# EAGLE design untitled (EAGLE 9.6.2)
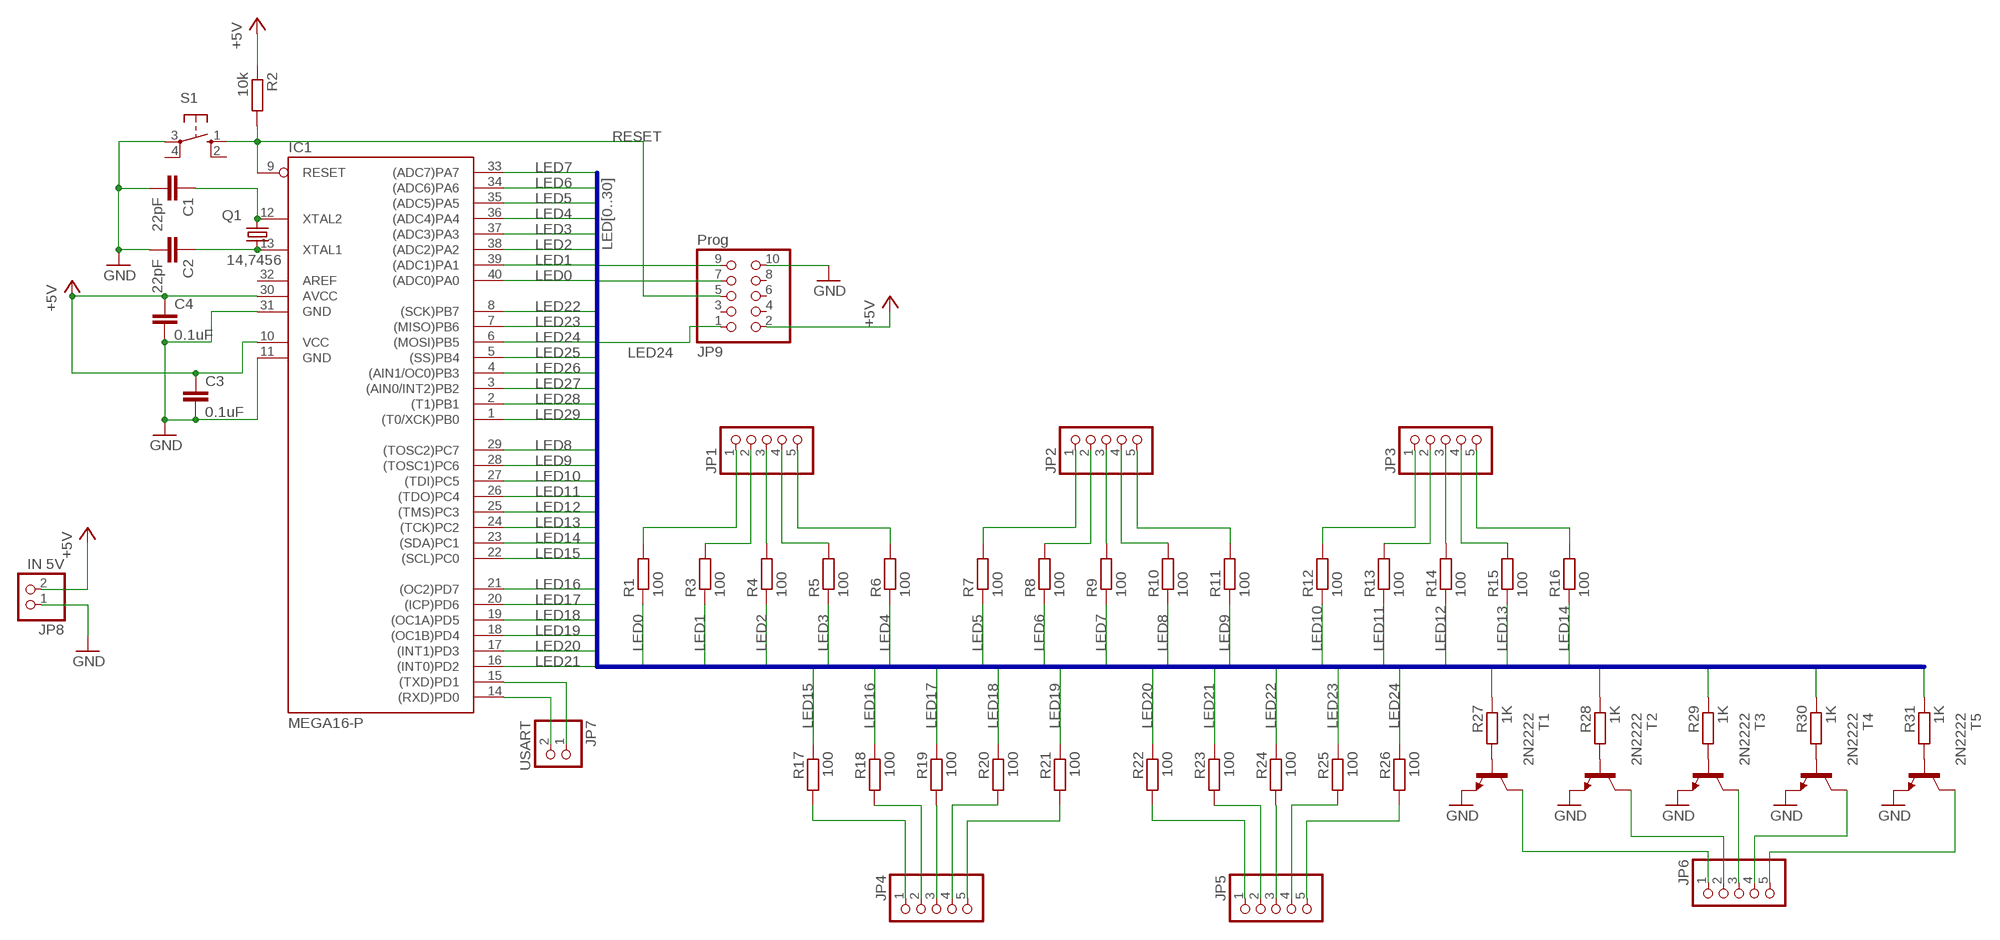
[diagram p0: schematic, sheet 1]

## Parts
C1  22pF  C-EU025-025X050  [C025-025X050]
C2  22pF  C-EU025-025X050  [C025-025X050]
C3  0.1uF  C-EU025-025X050  [C025-025X050]
C4  0.1uF  C-EU025-025X050  [C025-025X050]
IC1  MEGA16-P  [DIL40]
JP1  PINHD-1X5  [1X05]
JP2  PINHD-1X5  [1X05]
JP3  PINHD-1X5  [1X05]
JP4  PINHD-1X5  [1X05]
JP5  PINHD-1X5  [1X05]
JP6  PINHD-1X5  [1X05]
JP7  USART  PINHD-1X2/90  [1X02/90]
JP8  IN 5V  PINHD-1X2/90  [1X02/90]
JP9  Prog  PINHD-2X5  [2X05]
Q1  14,7456  CRYSTALHC49S  [HC49/S]
R1  100  R-EU_0207/7  [0207/7]
R2  10k  R-EU_0207/7  [0207/7]
R3  100  R-EU_0207/7  [0207/7]
R4  100  R-EU_0207/7  [0207/7]
R5  100  R-EU_0207/7  [0207/7]
R6  100  R-EU_0207/7  [0207/7]
R7  100  R-EU_0207/7  [0207/7]
R8  100  R-EU_0207/7  [0207/7]
R9  100  R-EU_0207/7  [0207/7]
R10  100  R-EU_0207/7  [0207/7]
R11  100  R-EU_0207/7  [0207/7]
R12  100  R-EU_0207/7  [0207/7]
R13  100  R-EU_0207/7  [0207/7]
R14  100  R-EU_0207/7  [0207/7]
R15  100  R-EU_0207/7  [0207/7]
R16  100  R-EU_0207/7  [0207/7]
R17  100  R-EU_0207/7  [0207/7]
R18  100  R-EU_0207/7  [0207/7]
R19  100  R-EU_0207/7  [0207/7]
R20  100  R-EU_0207/7  [0207/7]
R21  100  R-EU_0207/7  [0207/7]
R22  100  R-EU_0207/7  [0207/7]
R23  100  R-EU_0207/7  [0207/7]
R24  100  R-EU_0207/7  [0207/7]
R25  100  R-EU_0207/7  [0207/7]
R26  100  R-EU_0207/7  [0207/7]
R27  1K  R-EU_0207/7  [0207/7]
R28  1K  R-EU_0207/7  [0207/7]
R29  1K  R-EU_0207/7  [0207/7]
R30  1K  R-EU_0207/7  [0207/7]
R31  1K  R-EU_0207/7  [0207/7]
S1  10-XX  [B3F-10XX]
T1  2N2222  [TO18]
T2  2N2222  [TO18]
T3  2N2222  [TO18]
T4  2N2222  [TO18]
T5  2N2222  [TO18]

## Nets
+5V: C3.1 C4.1 IC1.10(VCC) IC1.30(AVCC) JP8.2 JP9.2 R2.1
GND: C1.2 C2.2 C3.2 C4.2 IC1.11(GND) IC1.31(GND) JP8.1 JP9.10 S1.3(P) T1.1(E) T2.1(E) T3.1(E) T4.1(E) T5.1(E)
LED0: IC1.40((ADC0)PA0) R1.1
LED1: IC1.39((ADC1)PA1) R3.1
LED2: IC1.38((ADC2)PA2) R4.1
LED3: IC1.37((ADC3)PA3) R5.1
LED4: IC1.36((ADC4)PA4) R6.1
LED5: IC1.35((ADC5)PA5) R7.1
LED6: IC1.34((ADC6)PA6) R8.1
LED7: IC1.33((ADC7)PA7) R9.1
LED8: IC1.29((TOSC2)PC7) R10.1
LED9: IC1.28((TOSC1)PC6) R11.1
LED10: IC1.27((TDI)PC5) R12.1
LED11: IC1.26((TDO)PC4) R13.1
LED12: IC1.25((TMS)PC3) R14.1
LED13: IC1.24((TCK)PC2) R15.1
LED14: IC1.23((SDA)PC1) R16.1
LED15: IC1.22((SCL)PC0) R17.1
LED16: IC1.21((OC2)PD7) R18.1
LED17: IC1.20((ICP)PD6) R19.1
LED18: IC1.19((OC1A)PD5) R20.1
LED19: IC1.18((OC1B)PD4) R21.1
LED20: IC1.17((INT1)PD3) R22.1
LED21: IC1.16((INT0)PD2) R23.1
LED22: IC1.8((SCK)PB7) JP9.7 R24.1
LED23: IC1.7((MISO)PB6) JP9.9 R25.1
LED24: IC1.6((MOSI)PB5) JP9.1 R26.1
LED25: IC1.5((SS)PB4) R27.1
LED26: IC1.4((AIN1/OC0)PB3) R28.1
LED27: IC1.3((AIN0/INT2)PB2) R29.1
LED28: IC1.2((T1)PB1) R30.1
LED29: IC1.1((T0/XCK)PB0) R31.1
N$2: JP1.3 R4.2
N$3: JP1.4 R5.2
N$4: JP1.5 R6.2
N$5: JP1.2 R3.2
N$6: JP1.1 R1.2
N$7: JP2.3 R9.2
N$8: JP2.4 R10.2
N$9: JP2.2 R8.2
N$10: JP2.5 R11.2
N$11: JP2.1 R7.2
N$12: JP3.3 R14.2
N$13: JP3.4 R15.2
N$14: JP3.2 R13.2
N$15: JP3.5 R16.2
N$16: JP3.1 R12.2
N$17: JP4.3 R19.2
N$18: JP4.4 R20.2
N$19: JP4.2 R18.2
N$20: JP4.5 R21.2
N$21: JP4.1 R17.2
N$22: JP5.3 R24.2
N$23: JP5.4 R25.2
N$24: JP5.2 R23.2
N$25: JP5.5 R26.2
N$26: JP5.1 R22.2
N$27: JP6.4 T4.3(C)
N$28: JP6.5 T5.3(C)
N$29: JP6.3 T3.3(C)
N$30: JP6.2 T2.3(C)
N$31: JP6.1 T1.3(C)
N$32: IC1.14((RXD)PD0) JP7.2
N$33: IC1.15((TXD)PD1) JP7.1
N$34: C1.1 IC1.12(XTAL2) Q1.2
N$35: C2.1 IC1.13(XTAL1) Q1.1
N$36: R27.2 T1.2(B)
N$37: R28.2 T2.2(B)
N$38: R29.2 T3.2(B)
N$39: R30.2 T4.2(B)
N$40: R31.2 T5.2(B)
RESET: IC1.9(RESET) JP9.5 R2.2 S1.1(S)
Unconnected: IC1.32(AREF) JP9.3 JP9.4 JP9.6 JP9.8 S1.2(S1) S1.4(P1)

## Buses
LED[0..30]

## Library data of the parts
C1-C4 = resistor:C-EU: CAPACITOR, European symbol
IC1 = atmel:MEGA16-P: MICROCONTROLLER 16 Kbytes FLASH 1 kbytes SRAM 512 bytes EEPROM USART 8-channel 10 bit ADC Source: avr.lbr; MPN: ATMEGA16-16PU; OC_FARNELL: 9171142; OC_NEWARK: 01M6885
JP1-JP6 = pinhead:PINHD-1X5: PIN HEADER
JP7 JP8 = pinhead:PINHD-1X2: PIN HEADER
JP9 = pinhead:PINHD-2X5: PIN HEADER
Q1 = crystal:CRYSTAL: CRYSTAL; OC_FARNELL: 1667008; OC_NEWARK: unknown
R1-R31 = resistor:R-EU_: RESISTOR, European symbol
S1 = switch-omron:10-XX: OMRON SWITCH; MPN: B3F-1000; OC_FARNELL: 176432; OC_NEWARK: 36M3542
T1-T5 = transistor:2N2222: NPN TRANSISTOR

## Board
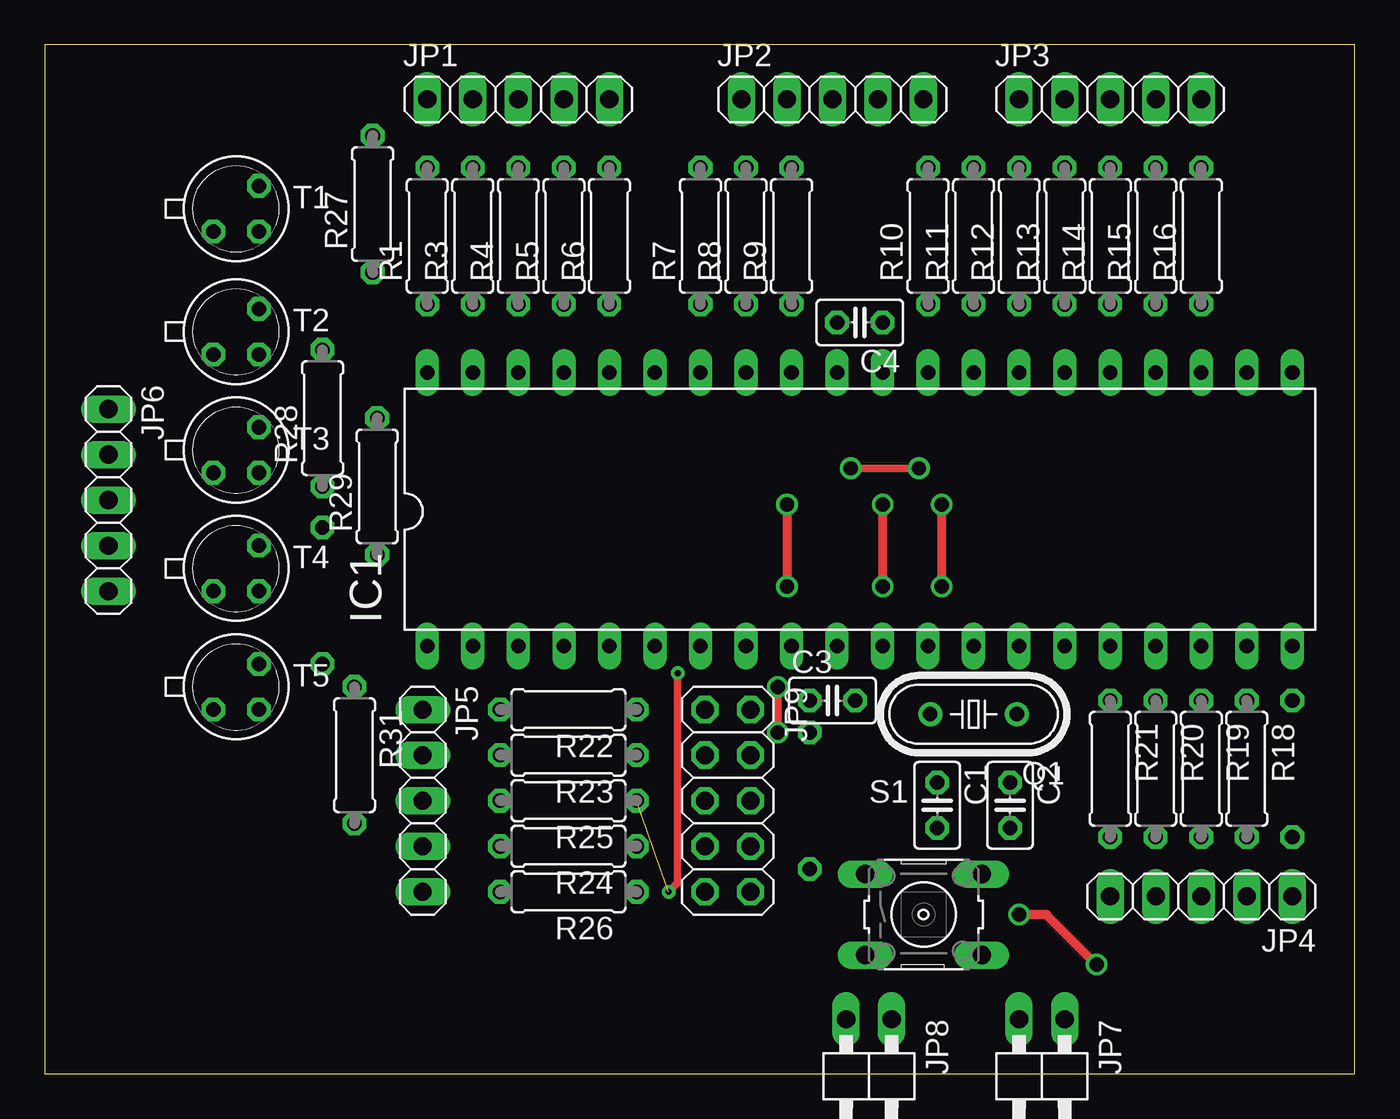
[diagram p1: board, top side]
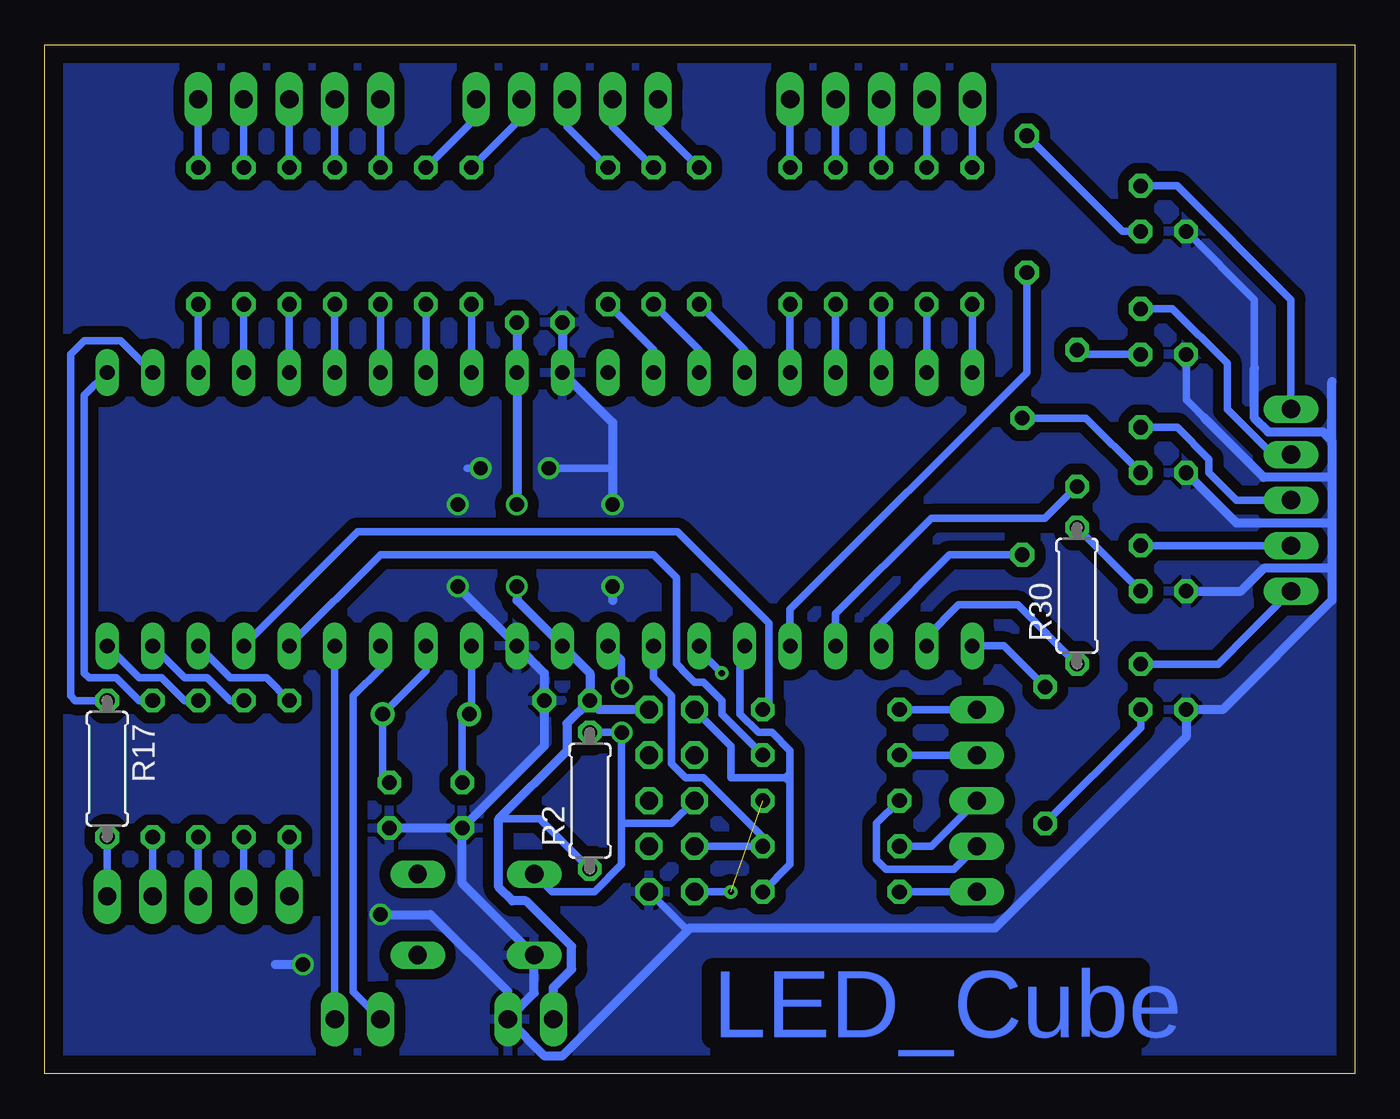
[diagram p2: board, bottom side, seen from below]

Size 73.08 x 57.39 mm. Coordinates in mm from the lower left corner, seen from the top.
Outline: 0,0 73.08,0 73.08,57.39 0,57.39 0,0
Copper layers (1*16): Top 0.035mm / dielectric 1.5mm / Bottom 0.035mm
Design rules "default": minimum track width 6mil, minimum drill 0.35mm, track to track 6mil, track to pad 6mil, pad to pad 6mil, via to via 6mil, smd to smd 6mil, copper to edge 40mil, drill to drill 6mil, minimum pad ring 10mil, minimum via ring 8mil, stop-mask expansion 4mil, vias tented up to drill 0mil, thermal gap 10mil

### Footprints (pad centres in the part's own frame; a part is rotated, then mirrored left to right if it is on the bottom)
C025-025X050 = drill 0.813 octagon: 1 -1.27,0; 2 1.27,0
DIL40 = drill 0.813 long: 1 -24.13,-7.62; 2 -21.59,-7.62; 3 -19.05,-7.62; 4 -16.51,-7.62; 5 -13.97,-7.62; 6 -11.43,-7.62; 7 -8.89,-7.62; 8 -6.35,-7.62; 9 -3.81,-7.62; 10 -1.27,-7.62; 11 1.27,-7.62; 12 3.81,-7.62; 13 6.35,-7.62; 14 8.89,-7.62; 15 11.43,-7.62; 16 13.97,-7.62; 17 16.51,-7.62; 18 19.05,-7.62; 19 21.59,-7.62; 20 24.13,-7.62; 21 24.13,7.62; 22 21.59,7.62; 23 19.05,7.62; 24 16.51,7.62; 25 13.97,7.62; 26 11.43,7.62; 27 8.89,7.62; 28 6.35,7.62; 29 3.81,7.62; 30 1.27,7.62; 31 -1.27,7.62; 32 -3.81,7.62; 33 -6.35,7.62; 34 -8.89,7.62; 35 -11.43,7.62; 36 -13.97,7.62; 37 -16.51,7.62; 38 -19.05,7.62; 39 -21.59,7.62; 40 -24.13,7.62
1X05 = drill 1.016 long: 1 -5.08,0; 2 -2.54,0; 3 0,0; 4 2.54,0; 5 5.08,0
1X02/90 = drill 1.016 long: 1 -1.27,-3.81; 2 1.27,-3.81
2X05 = drill 1.016 octagon: 1 -5.08,-1.27; 2 -5.08,1.27; 3 -2.54,-1.27; 4 -2.54,1.27; 5 0,-1.27; 6 0,1.27; 7 2.54,-1.27; 8 2.54,1.27; 9 5.08,-1.27; 10 5.08,1.27
HC49/S = drill 0.813: 1 -2.413,0; 2 2.413,0
0207/7 = drill 0.813 octagon: 1 -3.81,0; 2 3.81,0
B3F-10XX = drill 1.016 long: 1 -3.251,2.261; 2 3.251,2.261; 3 -3.251,-2.261; 4 3.251,-2.261
TO18 = drill 0.813 octagon: 1 -1.27,-1.27; 2 1.27,-1.27; 3 1.27,1.27

### Placement (x,y rotation side)
C1  49.78,14.99 270 top
C2  53.85,14.99 270 top
C3  43.94,20.83 0 top
C4  45.47,41.91 180 top
IC1  45.47,31.5 0 top
JP1  26.42,54.36 0 top
JP2  43.94,54.36 0 top
JP3  59.44,54.36 0 top
JP4  64.52,9.91 180 top
JP5  21.08,15.24 270 top
JP6  3.56,32 270 top
JP7  55.63,-0.76 180 top
JP8  45.97,-0.76 180 top
JP9  38.1,15.24 270 top
Q1  51.82,20.07 180 top
R1  21.34,46.74 90 top
R2  42.67,15.24 90 bottom
R3  23.88,46.74 90 top
R4  26.42,46.74 90 top
R5  28.96,46.74 90 top
R6  31.5,46.74 90 top
R7  36.58,46.74 90 top
R8  39.12,46.74 90 top
R9  41.66,46.74 90 top
R10  49.28,46.74 90 top
R11  51.82,46.74 90 top
R12  54.36,46.74 90 top
R13  56.9,46.74 90 top
R14  59.44,46.74 90 top
R15  61.98,46.74 90 top
R16  64.52,46.74 90 top
R17  69.6,17.02 270 bottom
R18  67.06,17.02 270 top
R19  64.52,17.02 270 top
R20  61.98,17.02 270 top
R21  59.44,17.02 270 top
R22  29.21,20.32 180 top
R23  29.21,17.78 180 top
R24  29.21,12.7 180 top
R25  29.21,15.24 180 top
R26  29.21,10.16 180 top
R27  18.29,48.51 90 top
R28  15.49,36.58 90 top
R29  18.54,32.77 90 top
R30  15.49,26.67 90 bottom
R31  17.27,17.78 270 top
S1  49.02,8.89 0 top
T1  10.67,48.26 0 top
T2  10.67,41.4 0 top
T3  10.67,34.8 0 top
T4  10.67,28.19 0 top
T5  10.67,21.59 0 top

### Tracks (layer width: path | path; a pad name or v marks a point on that pad's centre or on a via)
+5V  (via drill 0.8)
  Top 0.508: v46.74,31.75 v46.74,27.18
  Bottom 0.254: 42.93,20.57 C3.1
  Bottom 0.406: R2.1 45.47,14.22 47.75,14.22
  Bottom 0.508: C3.1 42.67,22.35 IC1.10 46.74,26.42 v46.74,27.18 | JP9.2 42.16,20.32 C3.1 | C4.1 IC1.30 v46.74,31.75 | JP8.2 44.7,4.83 43.69,5.84 43.69,7.11 46.23,9.65 46.99,9.65 47.75,10.41 47.75,14.22 43.94,18.03 43.94,19.56 C3.1
GND  (via drill 0.8)
  Top 0.406: v44.96,33.78 v48.77,33.78
  Top 0.508: v41.4,31.75 v41.4,27.18 | v58.67,6.1 55.88,8.89 v54.36,8.89 | v50.04,27.18 v50.04,31.75
  Bottom 0.406: 41.4,33.78 v44.96,33.78 | v48.77,33.78 49.53,33.78 | JP9.10 37.34,8.13 37.08,8.13 | T2.1 9.4,37.59 8.26,36.45 | 5.59,39.37 5.59,43.18 T1.1
  Bottom 0.508: C1.2 45.21,18.29 C3.2 45.21,22.35 IC1.11 v50.04,27.18 | C1.2 C2.2 | C4.2 IC1.31 41.4,36.32 41.4,33.78 v41.4,31.75 | 5.59,39.37 5.59,36.58 4.83,35.81 1.78,35.81 1.27,35.31 | T3.1 6.6,30.73 1.27,30.73 | T4.1 6.35,26.92 5.08,28.19 1.27,28.19 | 8.38,36.58 8.26,36.45 5.08,33.27 1.27,33.27 | 1.27,30.73 1.27,28.19 | 1.27,33.27 1.27,30.73 | 1.27,35.31 1.27,33.27 | 1.27,28.19 1.27,26.42 7.37,20.32 T5.1 9.4,18.8 20.07,8.13 37.08,8.13 44.22,0.99 45.19,0.99 JP8.1 | JP8.1 45.77,4.52 S1.3 49.78,10.64 C1.2 | v41.4,27.18 41.4,26.42 | JP8.1 47.24,4.57 51.56,8.89 v54.36,8.89 | v58.67,6.1 60.2,6.1 | 1.27,35.31 1.27,38.61
  pour Bottom (isolate 0.61): 0,0 73.15,0 73.15,57.4 0,57.4
LED0
  Bottom 0.406: IC1.40 R1.1
LED1
  Bottom 0.406: IC1.39 R3.1
LED2
  Bottom 0.406: IC1.38 R4.1
LED3
  Bottom 0.406: IC1.37 R5.1
LED4
  Bottom 0.406: IC1.36 R6.1
LED5
  Bottom 0.406: IC1.35 34.04,40.39 R7.1
LED6
  Bottom 0.406: IC1.34 36.58,40.39 R8.1
LED7
  Bottom 0.406: IC1.33 39.12,40.39 R9.1
LED8
  Bottom 0.406: R10.1 IC1.29
LED9
  Bottom 0.406: IC1.28 R11.1
LED10
  Bottom 0.406: R12.1 IC1.27
LED11
  Bottom 0.406: R13.1 IC1.26
LED12
  Bottom 0.406: IC1.25 R14.1
LED13
  Bottom 0.406: R15.1 IC1.24
LED14
  Bottom 0.406: R16.1 IC1.23
LED15
  Bottom 0.406: IC1.22 68.83,40.89 70.87,40.89 71.63,40.13 71.63,21.08 71.37,20.83 R17.1
LED16
  Bottom 0.406: R18.1 67.82,20.83 69.09,22.1 70.61,22.1 70.87,22.35 70.87,37.85 IC1.21
LED17
  Bottom 0.406: R19.1 65.28,20.83 66.55,22.1 67.82,22.1 IC1.20
LED18
  Bottom 0.406: R20.1 62.74,20.83 64.01,22.1 65.28,22.1 IC1.19
LED19
  Bottom 0.406: R21.1 60.71,22.1 62.74,22.1 IC1.18
LED20
  Bottom 0.406: R22.1 32.69,20.65 32.69,25.14 37.78,30.23 55.63,30.23 IC1.17
LED21
  Bottom 0.406: IC1.16 54.36,28.96 39.12,28.96 37.85,27.69 37.85,22.89 37.57,22.61 37.57,22.58 36.83,21.84 36.32,21.84 35.31,20.83 35.31,20.07 R23.1
LED22
  Bottom 0.406: 39.12,23.37 IC1.8 39.12,22.1 38.1,21.08 38.1,17.32 38.12,17.3 37.34,16.51 36.32,16.51 33.02,13.21 R24.1 JP9.7
LED23  (via drill 0.35)  (1 unrouted)
  Top 0.406: v35.31,22.35 35.31,10.67 v34.8,10.16
  Bottom 0.406: IC1.7 36.58,23.62 v35.31,22.35 | v34.8,10.16 JP9.9
LED24
  Bottom 0.406: IC1.6 34.29,23.62 34.29,20.07 33.27,19.05 32.51,19.05 31.5,18.03 31.5,16.76 | R26.1 31.5,11.68 31.5,16 31.5,16.26 | 31.5,16.76 31.5,16.26 | JP9.1 34.8,18.29 34.8,16.51 31.75,16.51 | 31.75,16.51 31.5,16.76 | 31.75,16.51 31.5,16.26
LED25
  Bottom 0.254: 31.5,24.89 IC1.5
  Bottom 0.406: IC1.5 31.5,25.91 18.29,39.12 R27.1
LED26
  Bottom 0.406: R28.1 17.27,30.99 23.62,30.99 28.96,25.65 IC1.4
LED27
  Bottom 0.406: IC1.3 26.42,25.15 22.61,28.96 R29.1
LED28
  Bottom 0.406: R30.1 18.8,26.16 22.1,26.16 23.88,24.38 IC1.2
LED29
  Bottom 0.406: R31.1 19.56,23.88 IC1.1
N$2
  Bottom 0.406: R4.2 JP1.3
N$3
  Bottom 0.406: R5.2 JP1.4
N$4
  Bottom 0.406: JP1.5 R6.2
N$5
  Bottom 0.406: R3.2 JP1.2
N$6
  Bottom 0.406: R1.2 JP1.1
N$7
  Bottom 0.406: JP2.3 43.94,52.83 R9.2
N$8
  Bottom 0.406: JP2.4 46.48,53.34 R10.2
N$9
  Bottom 0.406: JP2.2 41.4,52.83 R8.2
N$10
  Bottom 0.406: JP2.5 49.02,53.34 R11.2
N$11
  Bottom 0.406: JP2.1 38.86,52.83 R7.2
N$12
  Bottom 0.406: R14.2 JP3.3
N$13
  Bottom 0.406: JP3.4 R15.2
N$14
  Bottom 0.406: JP3.2 R13.2
N$15
  Bottom 0.406: R16.2 JP3.5
N$16
  Bottom 0.406: R12.2 JP3.1
N$17
  Bottom 0.406: R19.2 JP4.3
N$18
  Bottom 0.406: R20.2 JP4.4
N$19
  Bottom 0.406: R18.2 JP4.2
N$20
  Bottom 0.406: R21.2 JP4.5
N$21
  Bottom 0.406: R17.2 JP4.1
N$22
  Bottom 0.406: R24.2 23.62,12.7 JP5.3
N$23
  Bottom 0.406: R25.2 26.67,13.97 26.67,11.94 26.16,11.43 22.35,11.43 JP5.4
N$24
  Bottom 0.406: R23.2 JP5.2
N$25
  Bottom 0.406: R26.2 JP5.5
N$26
  Bottom 0.406: JP5.1 R22.2
N$27
  Bottom 0.406: T4.3 JP6.4
N$28
  Bottom 0.406: T5.3 7.62,22.86 5.84,24.64 JP6.5
N$29
  Bottom 0.406: JP6.3 6.6,32 8.13,33.53 8.13,34.29 9.91,36.07 T3.3
N$30
  Bottom 0.406: JP6.2 4.57,34.54 7.11,37.08 7.11,39.62 10.16,42.67 T2.3
N$31
  Bottom 0.406: JP6.1 3.56,43.18 9.91,49.53 T1.3
N$32
  Bottom 0.406: IC1.14 54.36,22.61 55.88,21.08 55.88,4.57 JP7.2
N$33
  Bottom 0.406: IC1.15 JP7.1
N$34
  Bottom 0.254: 49.28,20.19 Q1.2
  Bottom 0.406: IC1.12 49.28,20.19 | Q1.2 49.78,19.69 C1.1
N$35
  Bottom 0.406: IC1.13 51.82,22.48 Q1.1 54.23,16.64 C2.1
N$36
  Bottom 0.406: R27.2 12.95,46.99 T1.2
N$37
  Bottom 0.406: R28.2 15.24,40.13 T2.2
N$38
  Bottom 0.406: T3.2 14.99,36.58 R29.2
N$39
  Bottom 0.406: R30.2 T4.2
N$40
  Bottom 0.406: R31.2 11.94,19.3 T5.2
RESET  (via drill 0.8)
  Top 0.406: v40.89,19.05 v40.89,21.59
  Bottom 0.406: v40.89,21.59 40.89,23.11 IC1.9 | R2.2 v40.89,19.05 40.89,13.97 | 40.89,13.97 40.89,11.68 42.42,10.16 44.78,10.16 S1.1 | 40.89,13.97 38.35,13.97 38.1,13.97 JP9.5

### Text on the board
Bottom: LED_Cube